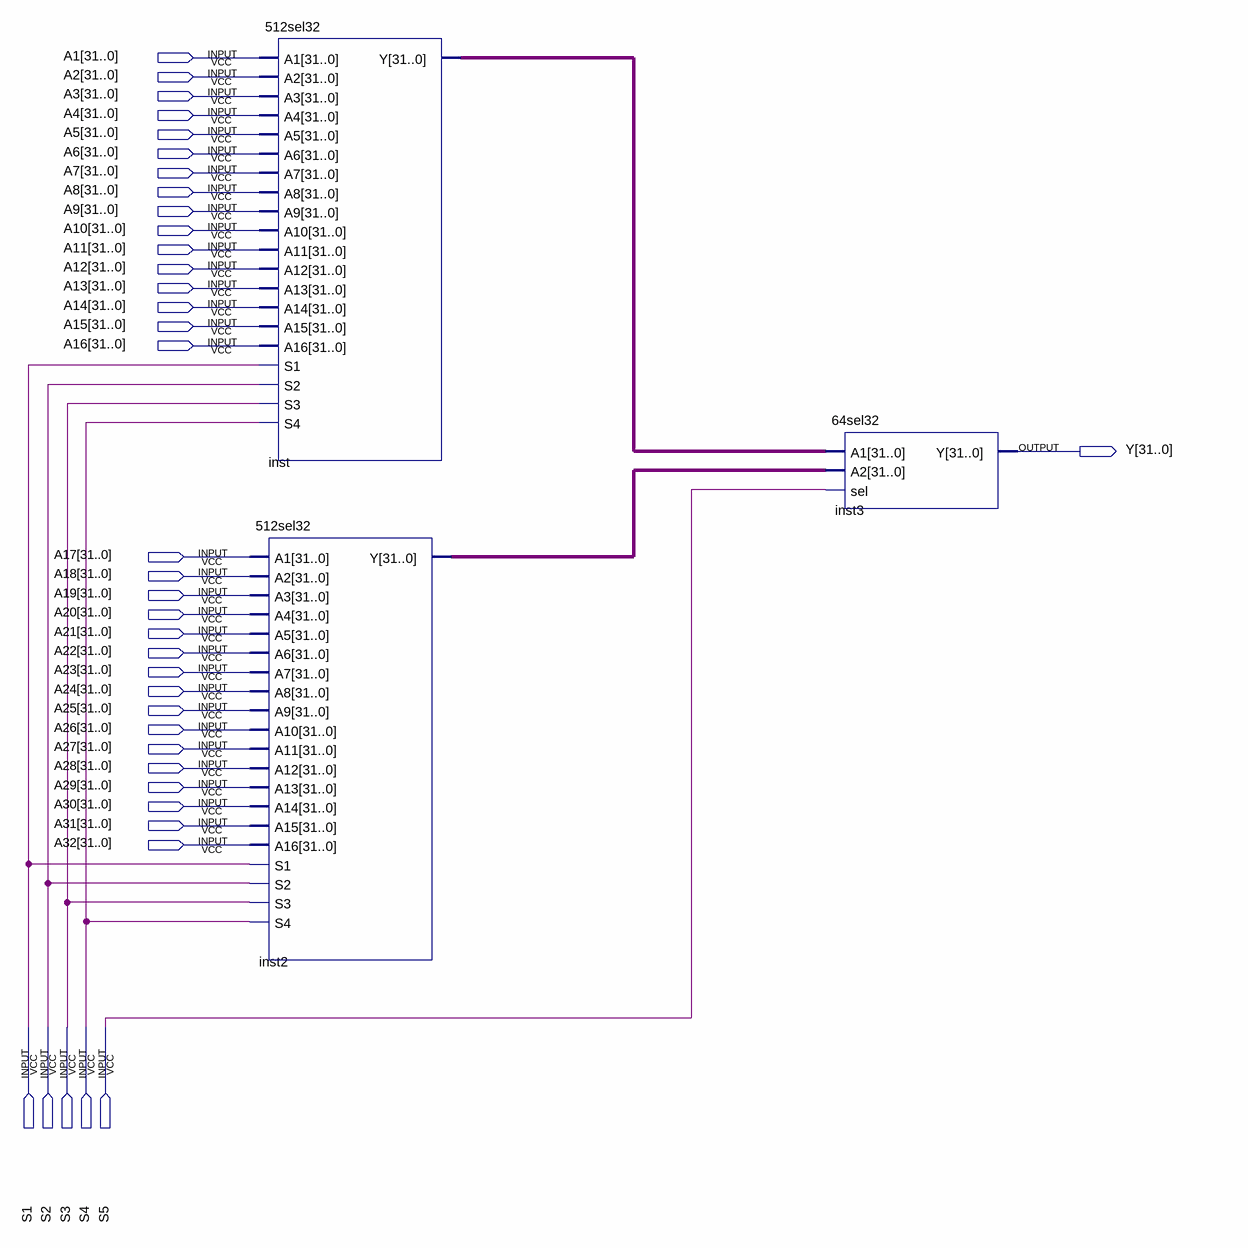
[diagram p0: schematic sheet]
// Quartus schematic 1024sel32.bdf as structural Verilog: 3 symbols, 38 pins
module \1024sel32  (
  input  [31:0] A1,
  input  [31:0] A2,
  input  [31:0] A3,
  input  [31:0] A4,
  input  [31:0] A5,
  input  [31:0] A6,
  input  [31:0] A7,
  input  [31:0] A8,
  input  [31:0] A9,
  input  [31:0] A10,
  input  [31:0] A11,
  input  [31:0] A12,
  input  [31:0] A13,
  input  [31:0] A14,
  input  [31:0] A15,
  input  [31:0] A16,
  input  [31:0] A17,
  input  [31:0] A18,
  input  [31:0] A19,
  input  [31:0] A20,
  input  [31:0] A21,
  input  [31:0] A22,
  input  [31:0] A23,
  input  [31:0] A24,
  input  [31:0] A25,
  input  [31:0] A26,
  input  [31:0] A27,
  input  [31:0] A28,
  input  [31:0] A29,
  input  [31:0] A30,
  input  [31:0] A31,
  input  [31:0] A32,
  input  S1,
  input  S2,
  input  S3,
  input  S4,
  input  S5,
  output [31:0] Y
);

  wire [31:0] inst2_y, inst_y;

  \512sel32  inst (
    .A1(A1), .A2(A2), .A3(A3), .A4(A4), .A5(A5), .A6(A6), .A7(A7), .A8(A8), .A9(A9), .A10(A10), .A11(A11),
    .A12(A12), .A13(A13), .A14(A14), .A15(A15), .A16(A16), .S1(S1), .S2(S2), .S3(S3), .S4(S4), .Y(inst_y));
  \512sel32  inst2 (
    .A1(A17), .A2(A18), .A3(A19), .A4(A20), .A5(A21), .A6(A22), .A7(A23), .A8(A24), .A9(A25), .A10(A26),
    .A11(A27), .A12(A28), .A13(A29), .A14(A30), .A15(A31), .A16(A32), .S1(S1), .S2(S2), .S3(S3), .S4(S4),
    .Y(inst2_y));
  \64sel32  inst3 (.A1(inst_y), .A2(inst2_y), .sel(S5), .Y(Y));
endmodule
